# Altium schematic sheet Sheet1.SchDoc
size A3
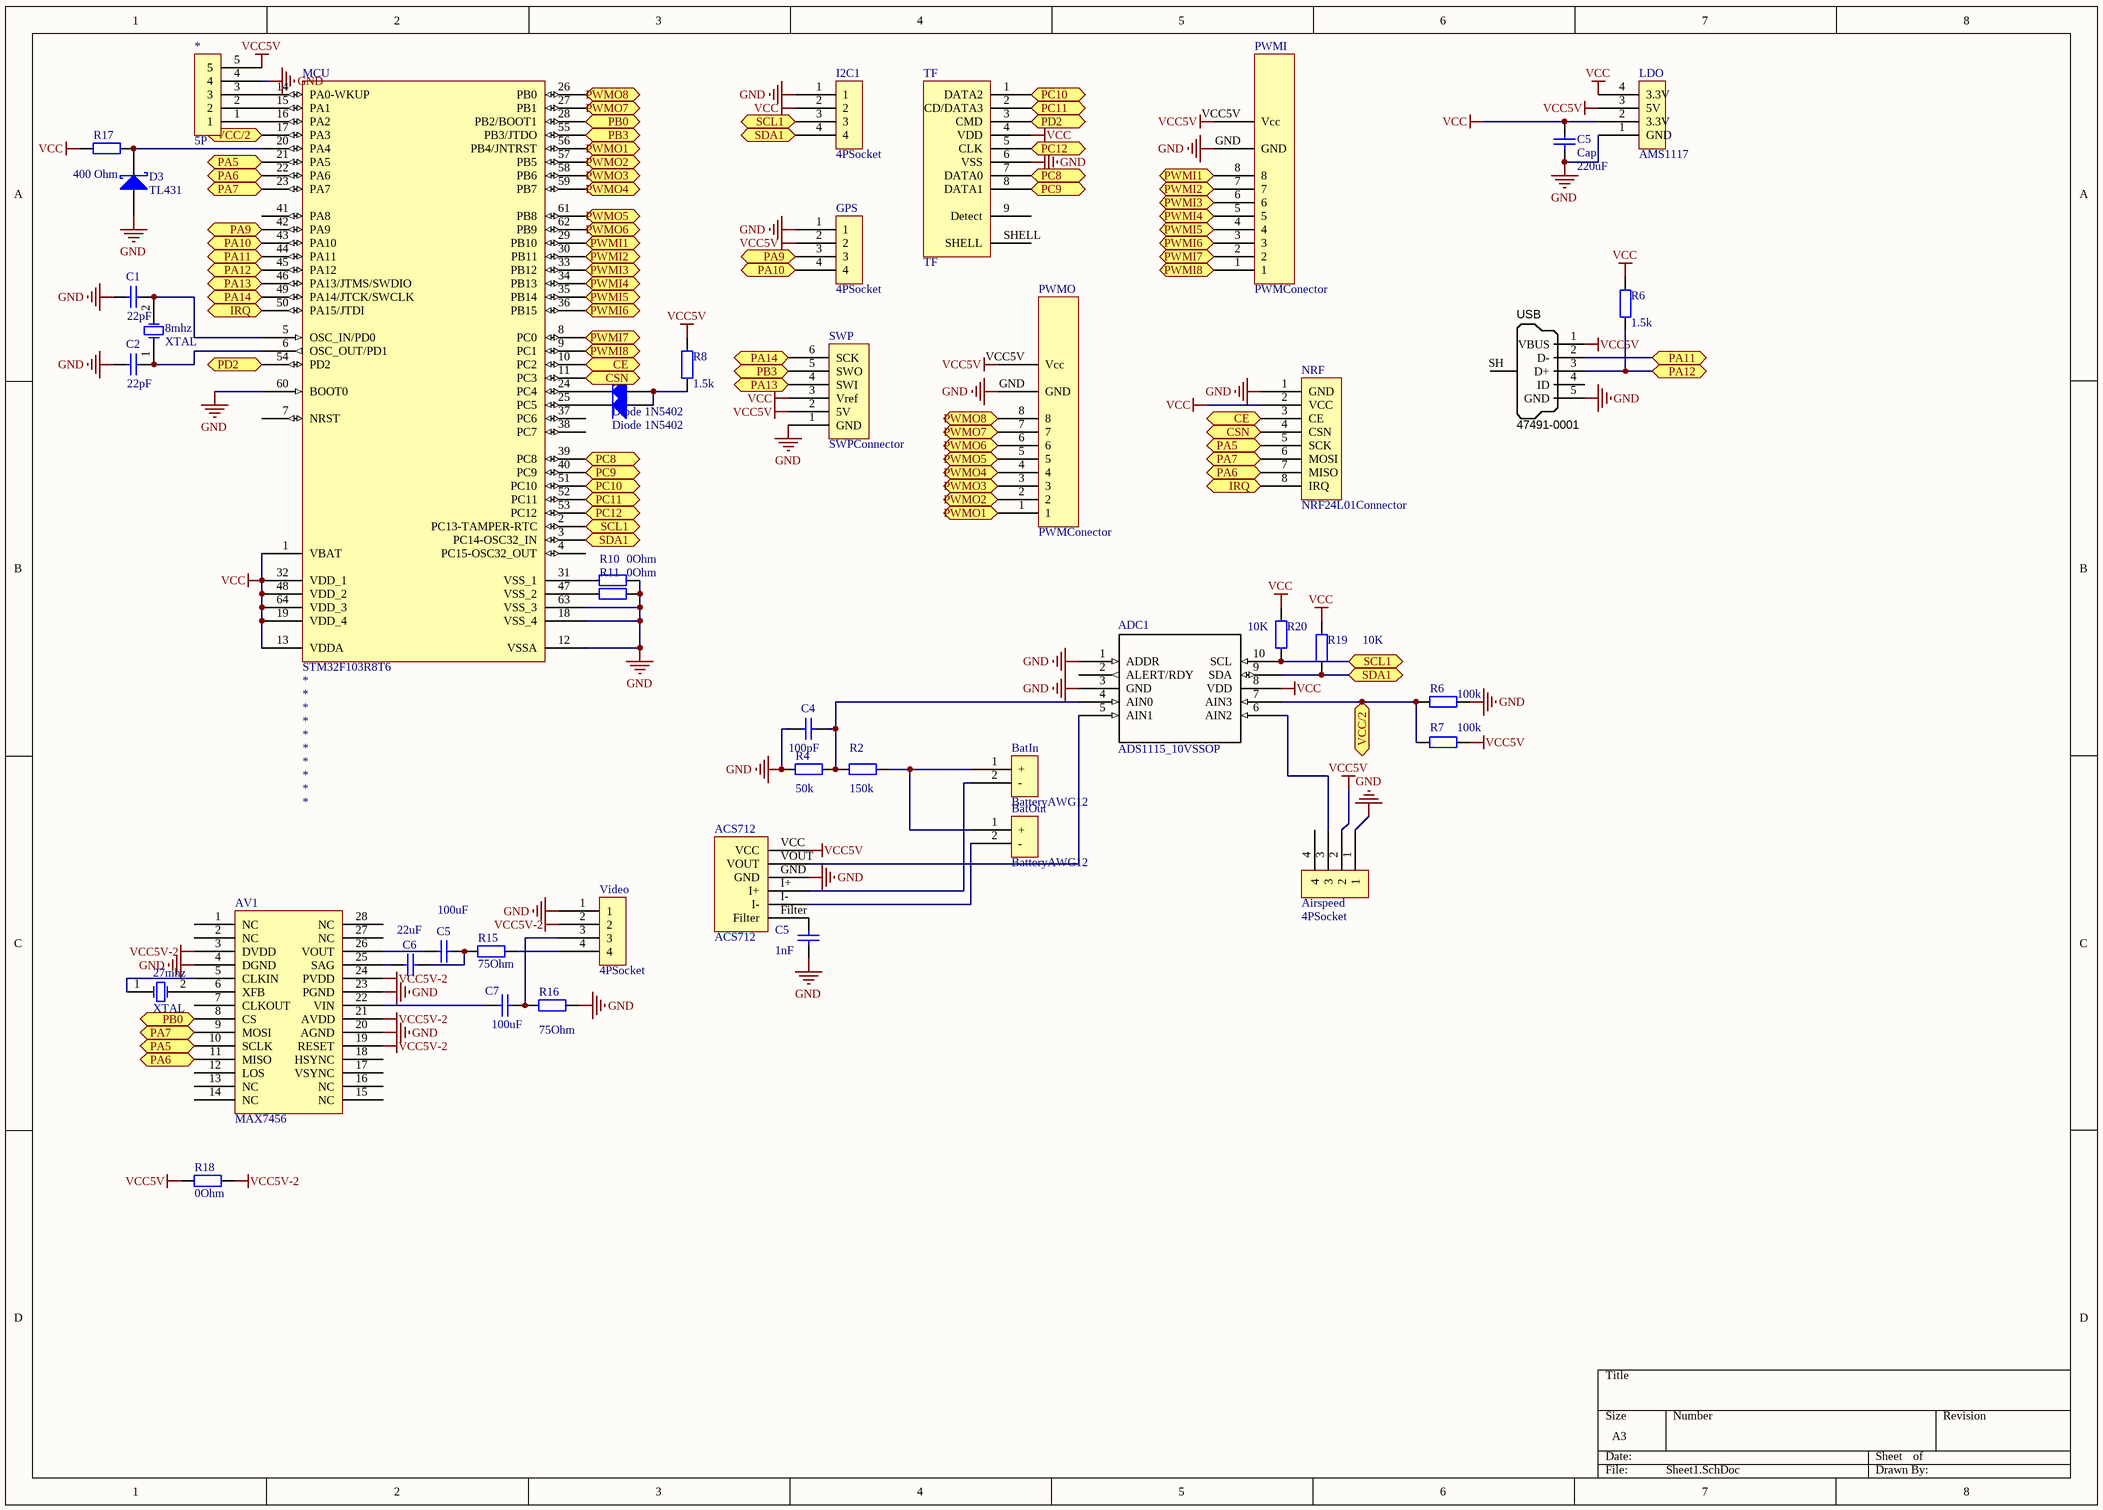
[diagram p0: Sheet1.SchDoc]

## Parts
(Parts that share a designator on the sheet are numbered #1, #2 ... from top to bottom, then left to right.)
8mhz  XTAL  [5032]
27mhz  XTAL  [5032]
*  5P  [5P-2]
ACS712  ACS712  [ACS712\]
ADC1  ADS1115_10VSSOP  [10VSSOP]
Airspeed  4PSocket  [4pSocket]
AV1  MAX7456  [28TSSOP]
BatIn  BatteryAWG12  [Battery_AWG12]
BatOut  BatteryAWG12  [Battery_AWG12]
C1  value 22pF  [0603]
C2  value 22pF  [0603]
C4  value 100pF  [0603]
C5#1  Cap  value 220uF  [1210]
C5#2  value 100uF  [1210]
C5#3  value 1nF  [0603]
C6  value 22uF  [1210]
C7  value 100uF  [0603]
D1  Diode 1N5402  [0603]
D2  Diode 1N5402  [0603]
D3  TL431  [TL431]
GPS  4PSocket  [4pSocket]
I2C1  4PSocket  [4pSocket]
LDO  AMS1117  [SOT-223]
MCU  STM32F103R8T6  [LQFP64_N]
NRF  NRF24L01Connector  [NRF24L01Pad]
PWMI  PWMConector  [PWMConnector]
PWMO  PWMConector  [PWMConnector]
R2  value 150k  [0603]
R4  value 50k  [0603]
R6#1  value 1.5k  [0603]
R6#2  value 100k  [0603]
R7  value 100k  [0603]
R8  value 1.5k  [0603]
R10  value 0Ohm  [0603]
R11  value 0Ohm  [0603]
R15  value 75Ohm  [0603]
R16  value 75Ohm  [0603]
R17  value 400 Ohm  [0603]
R18  value 0Ohm  [0603]
R19  value 10K  [0603]
R20  value 10K  [0603]
SWP  SWPConnector  [SWPConnector]
TF  TF  [TF]
USB  Manufacturer Part Number 1: 47491-0001  [USB]  (hidden comment: USB Micro Type B)
Video  4PSocket  [4pSocket]

## Ports
CE, CSN, IRQ, PA5, PA6, PA7, PA9, PA10, PA11, PA12, PA13, PA14, PB0, PB3, PC8, PC9, PC10, PC11, PC12, PD2, PWMI1, PWMI2, PWMI3, PWMI4, PWMI5, PWMI6, PWMI7, PWMI8, PWMO1, PWMO2, PWMO3, PWMO4, PWMO5, PWMO6, PWMO7, PWMO8, SCL1, SDA1, VCC/2

## Nets
GND: *.4 ACS712.GND ADC1.1(ADDR) ADC1.3(GND) Airspeed.1 AV1.4(DGND) AV1.20(AGND) AV1.23(PGND) C1.1 C2.1 C4.1 C5#1.1 C5#3.1 D3.1(A) GPS.1 I2C1.1 LDO.1(GND) MCU.12(VSSA) MCU.18(VSS_4) MCU.60(BOOT0) MCU.63(VSS_3) NRF.1(GND) PWMI.GND PWMO.GND R4.1 R6#2.1 R10.2 R11.2 R16.1 SWP.1(GND) TF.6(VSS) USB.5(GND) Video.1
VCC: ADC1.8(VDD) C5#1.2 I2C1.2 LDO.2(3.3V) LDO.4(3.3V) MCU.1(VBAT) MCU.13(VDDA) MCU.19(VDD_4) MCU.32(VDD_1) MCU.48(VDD_2) MCU.64(VDD_3) NRF.2(VCC) R6#1.2 R17.2 R19.1 R20.1 SWP.3(Vref) TF.4(VDD)
VCC5V: *.5 ACS712.VCC Airspeed.2 GPS.2 LDO.3(5V) PWMI.VCC5V(Vcc) PWMO.VCC5V(Vcc) R7.2 R8.2 R18.1 SWP.2(5V) USB.1(VBUS)
VCC5V-2: AV1.3(DVDD) AV1.19(RESET) AV1.21(AVDD) AV1.24(PVDD) R18.2 Video.2
CE: MCU.10(PC2) NRF.3(CE) ; port CE
CSN: MCU.11(PC3) NRF.4(CSN) ; port CSN
IRQ: MCU.50(PA15/JTDI) NRF.8(IRQ) ; port IRQ
PA5: AV1.10(SCLK) MCU.21(PA5) NRF.5(SCK) ; port PA5
PA6: AV1.11(MISO) MCU.22(PA6) NRF.7(MISO) ; port PA6
PA7: AV1.9(MOSI) MCU.23(PA7) NRF.6(MOSI) ; port PA7
PA9: GPS.3 MCU.42(PA9) ; port PA9
PA10: GPS.4 MCU.43(PA10) ; port PA10
PA11: MCU.44(PA11) USB.2(D-) ; port PA11
PA12: MCU.45(PA12) R6#1.1 USB.3(D+) ; port PA12
PA13: MCU.46(PA13/JTMS/SWDIO) SWP.4(SWI) ; port PA13
PA14: MCU.49(PA14/JTCK/SWCLK) SWP.6(SCK) ; port PA14
PB0: AV1.8(CS) MCU.28(PB2/BOOT1) ; port PB0
PB3: MCU.55(PB3/JTDO) SWP.5(SWO) ; port PB3
PC8: MCU.39(PC8) TF.7(DATA0) ; port PC8
PC9: MCU.40(PC9) TF.8(DATA1) ; port PC9
PC10: MCU.51(PC10) TF.1(DATA2) ; port PC10
PC11: MCU.52(PC11) TF.2(CD/DATA3) ; port PC11
PC12: MCU.53(PC12) TF.5(CLK) ; port PC12
PD2: MCU.54(PD2) TF.3(CMD) ; port PD2
PWMI1: MCU.29(PB10) PWMI.8 ; port PWMI1
PWMI2: MCU.30(PB11) PWMI.7 ; port PWMI2
PWMI3: MCU.33(PB12) PWMI.6 ; port PWMI3
PWMI4: MCU.34(PB13) PWMI.5 ; port PWMI4
PWMI5: MCU.35(PB14) PWMI.4 ; port PWMI5
PWMI6: MCU.36(PB15) PWMI.3 ; port PWMI6
PWMI7: MCU.8(PC0) PWMI.2 ; port PWMI7
PWMI8: MCU.9(PC1) PWMI.1 ; port PWMI8
PWMO1: MCU.56(PB4/JNTRST) PWMO.1 ; port PWMO1
PWMO2: MCU.57(PB5) PWMO.2 ; port PWMO2
PWMO3: MCU.58(PB6) PWMO.3 ; port PWMO3
PWMO4: MCU.59(PB7) PWMO.4 ; port PWMO4
PWMO5: MCU.61(PB8) PWMO.5 ; port PWMO5
PWMO6: MCU.62(PB9) PWMO.6 ; port PWMO6
PWMO7: MCU.27(PB1) PWMO.7 ; port PWMO7
PWMO8: MCU.26(PB0) PWMO.8 ; port PWMO8
SCL1: ADC1.10(SCL) I2C1.3 MCU.2(PC13-TAMPER-RTC) R20.2 ; port SCL1
SDA1: ADC1.9(SDA) I2C1.4 MCU.3(PC14-OSC32_IN) R19.2 ; port SDA1
VCC/2: ADC1.7(AIN3) MCU.17(PA3) R6#2.2 R7.1 ; port VCC/2
Net8mhz_1: 8mhz.1(OSC1) C2.2 MCU.6(OSC_OUT/PD1)
Net8mhz_2: 8mhz.2(OSC2) C1.2 MCU.5(OSC_IN/PD0)
Net27mhz_1: 27mhz.1(OSC1) AV1.5(CLKIN)
Net27mhz_2: 27mhz.2(OSC2) AV1.6(XFB)
Net*_1: *.1 MCU.16(PA2)
Net*_2: *.2 MCU.15(PA1)
Net*_3: *.3 MCU.14(PA0-WKUP)
NetACS712_Filter: ACS712.Filter C5#3.2
NetACS712_I+: ACS712.I+ BatIn.2(-)
NetACS712_I-: ACS712.I- BatOut.2(-)
NetACS712_VOUT: ACS712.VOUT ADC1.5(AIN1)
NetADC1_4: ADC1.4(AIN0) C4.2 R2.1 R4.2
NetADC1_6: ADC1.6(AIN2) Airspeed.3
NetAV1_22: AV1.22(VIN) C7.1
NetAV1_25: AV1.25(SAG) C6.1
NetAV1_26: AV1.26(VOUT) C5#2.1
NetBatIn_1: BatIn.1(+) BatOut.1(+) R2.2
NetC5#2_2: C5#2.2 C6.2 R15.1
NetC7_2: C7.2 R16.2 Video.3
NetD1_1: D1.1(A) D2.1(A) R8.1
NetD1_2: D1.2(K) MCU.24(PC4)
NetD2_2: D2.2(K) MCU.25(PC5)
NetD3_3: D3.3(K) MCU.20(PA4) R17.1
NetMCU_31: MCU.31(VSS_1) R10.1
NetMCU_47: MCU.47(VSS_2) R11.1
NetR15_2: R15.2 Video.4

Not connected (* = marked no-connect by the designer): ADC1 2(ALERT/RDY); Airspeed 4; AV1 1(NC) 2(NC) 7(CLKOUT) 12(LOS) 13(NC) 14(NC) 15(NC) 16(NC) 17(VSYNC) 18(HSYNC) 27(NC) 28(NC); MCU 4(PC15-OSC32_OUT) 7(NRST) 37(PC6) 38(PC7) 41(PA8); TF 9(Detect) SHELL; USB 4(ID) SH(Shell)

## Library data of the parts
8mhz 27mhz = XTAL: Crystal Oscillator; Published: 8-Jun-2000; LatestRevisionDate: 17-Jul-2002; LatestRevisionNote: Re-released for DXP Platform.; PackageReference: R38; Publisher: Altium Limited; PackageDescription: Crystal, Thru-Hole; 2 Leads; Body 3.1 x 8.2 mm (Dia.xH)
ACS712 = ACS712: pin to pad: Filter>6 GND>5 I+>2 I->4 VCC>8 VOUT>7
ADC1 = ADS1115_10VSSOP: Manufacturer: Texas Instruments; INDUSTRY_STD_PKG_TYPE: MSOP; FAMILY_NAME: PRECISION ADC (<=10MSPS); PIN_COUNT: 10; PACKAGE_DESIGNATOR: DGS; Datasheet URL: http://www.ti.com/lit/gpn/ADS1115; GENERIC_PART_NUMBER: ADS1115; RefDes: RefDes; Type: DEV; Value: Value
C1 C2 C5#1 = Cap: Capacitor; Published: 8-Jun-2000; LatestRevisionDate: 17-Jul-2002; LatestRevisionNote: Re-released for DXP Platform.; PackageReference: RAD-0.3; Publisher: Altium Limited; PackageDescription: Radial Cap, Thru-Hole; 2 Leads; 0.3 in Pin Spacing
C4 C5#2 C5#3 C6 C7 = Cap Semi: Capacitor (Semiconductor SIM Model); Published: 8-Jun-2000; LatestRevisionDate: 29-May-2009; LatestRevisionNote: IPC-7351 Footprint Added.; PackageReference: C1206; Publisher: Altium Limited; PackageDescription: Chip Capacitor
D1 D2 = Diode 1N5402: 3 Amp General Purpose Rectifier; Published: 8-Jun-2000; LatestRevisionDate: 17-Jul-2002; LatestRevisionNote: Re-released for DXP Platform.; DatasheetVersion: 1998; PackageVersion: Aug-1999; PackageReference: DO-201AD; Publisher: Altium Limited; PackageDescription: Diode, Axial; Body 9.5 x 5.6 mm (LxDia. max), Lead Dia. 1.32 mm (max); ComponentLink1Description: Manufacturer Link; ComponentLink1URL: http://www.fairchildsemi.com/; ComponentLink2Description: Datasheet; ComponentLink2URL: http://www.fairchildsemi.com/ds/1N%2F1N5400.pdf
D3 = Diode BAT17: Silicon RF Schottky Diode for Mixer Applications in the VHF/UHF Range; pin to pad: 1>3 3>1; Note: Pin 2 is not connected and not drawn.; Published: 21-Mar-2003; LatestRevisionDate: 29-May-2009; LatestRevisionNote: IPC-7351 Footprint Added.; DatasheetVersion: Oct-1999; PackageVersion: Sep-2001; PackageReference: SOT-23; Publisher: Altium Limited; PackageDescription: 3-Pin SOT-23 Package 0.95 mm Pitch, 2.5 mm Lead Span; ComponentLink1Description: Manufacturer Link; ComponentLink1URL: http://www.infineon.com/; ComponentLink2Description: Datasheet; ComponentLink2URL: http://www.infineon.com/upload/Document/cmc_upload/documents/009/363/bat17series.pdf
MCU = STM32F103R8T6: STM32 ARM-based 32-bit MCU with 64 Kbytes Flash, 64-pin LQFP, Industrial Temperature; Published: *; DatasheetVersion: *; PackageVersion: *; PackageReference: *; Publisher: *; PackageDescription: *; ComponentLink1Description: *; ComponentLink1URL: *; ComponentLink2Description: *; ComponentLink2URL: *
R2 R4 R6#1 R6#2 R7 R8 R10 R11 R15-R20 = Res2: Resistor; Published: 8-Jun-2000; LatestRevisionDate: 17-Jul-2002; LatestRevisionNote: Re-released for DXP Platform.; PackageReference: AXIAL-0.4; Publisher: Altium Limited; PackageDescription: Axial Device, Thru-Hole; 2 Leads; 0.4 in Pin Spacing
USB = USB_Micro_TypeB: Connector SMD USB Micro Type B middle mount; Manufacturer 1: Molex Inc; SCDType: undef; Package / Case: SMD; Supplier 1: Digi-Key; Supplier Part Number 1: WM17142CT-ND